# EasyEDA Pro project ProProject_IR sensor board_2024-06-21.epro, schematic Schematic1
Create Date: 2024-04-04; Page Name: P1; Project Name: IR sensor board; Schematic Name: Schematic1; Update Date: 2024-04-17; Company: EasyEDA.com; Drawn: EasyEDA; Page Size: A4; Part Number: JLCPCB-002; Reviewed: EasyEDA; Version: V0.1
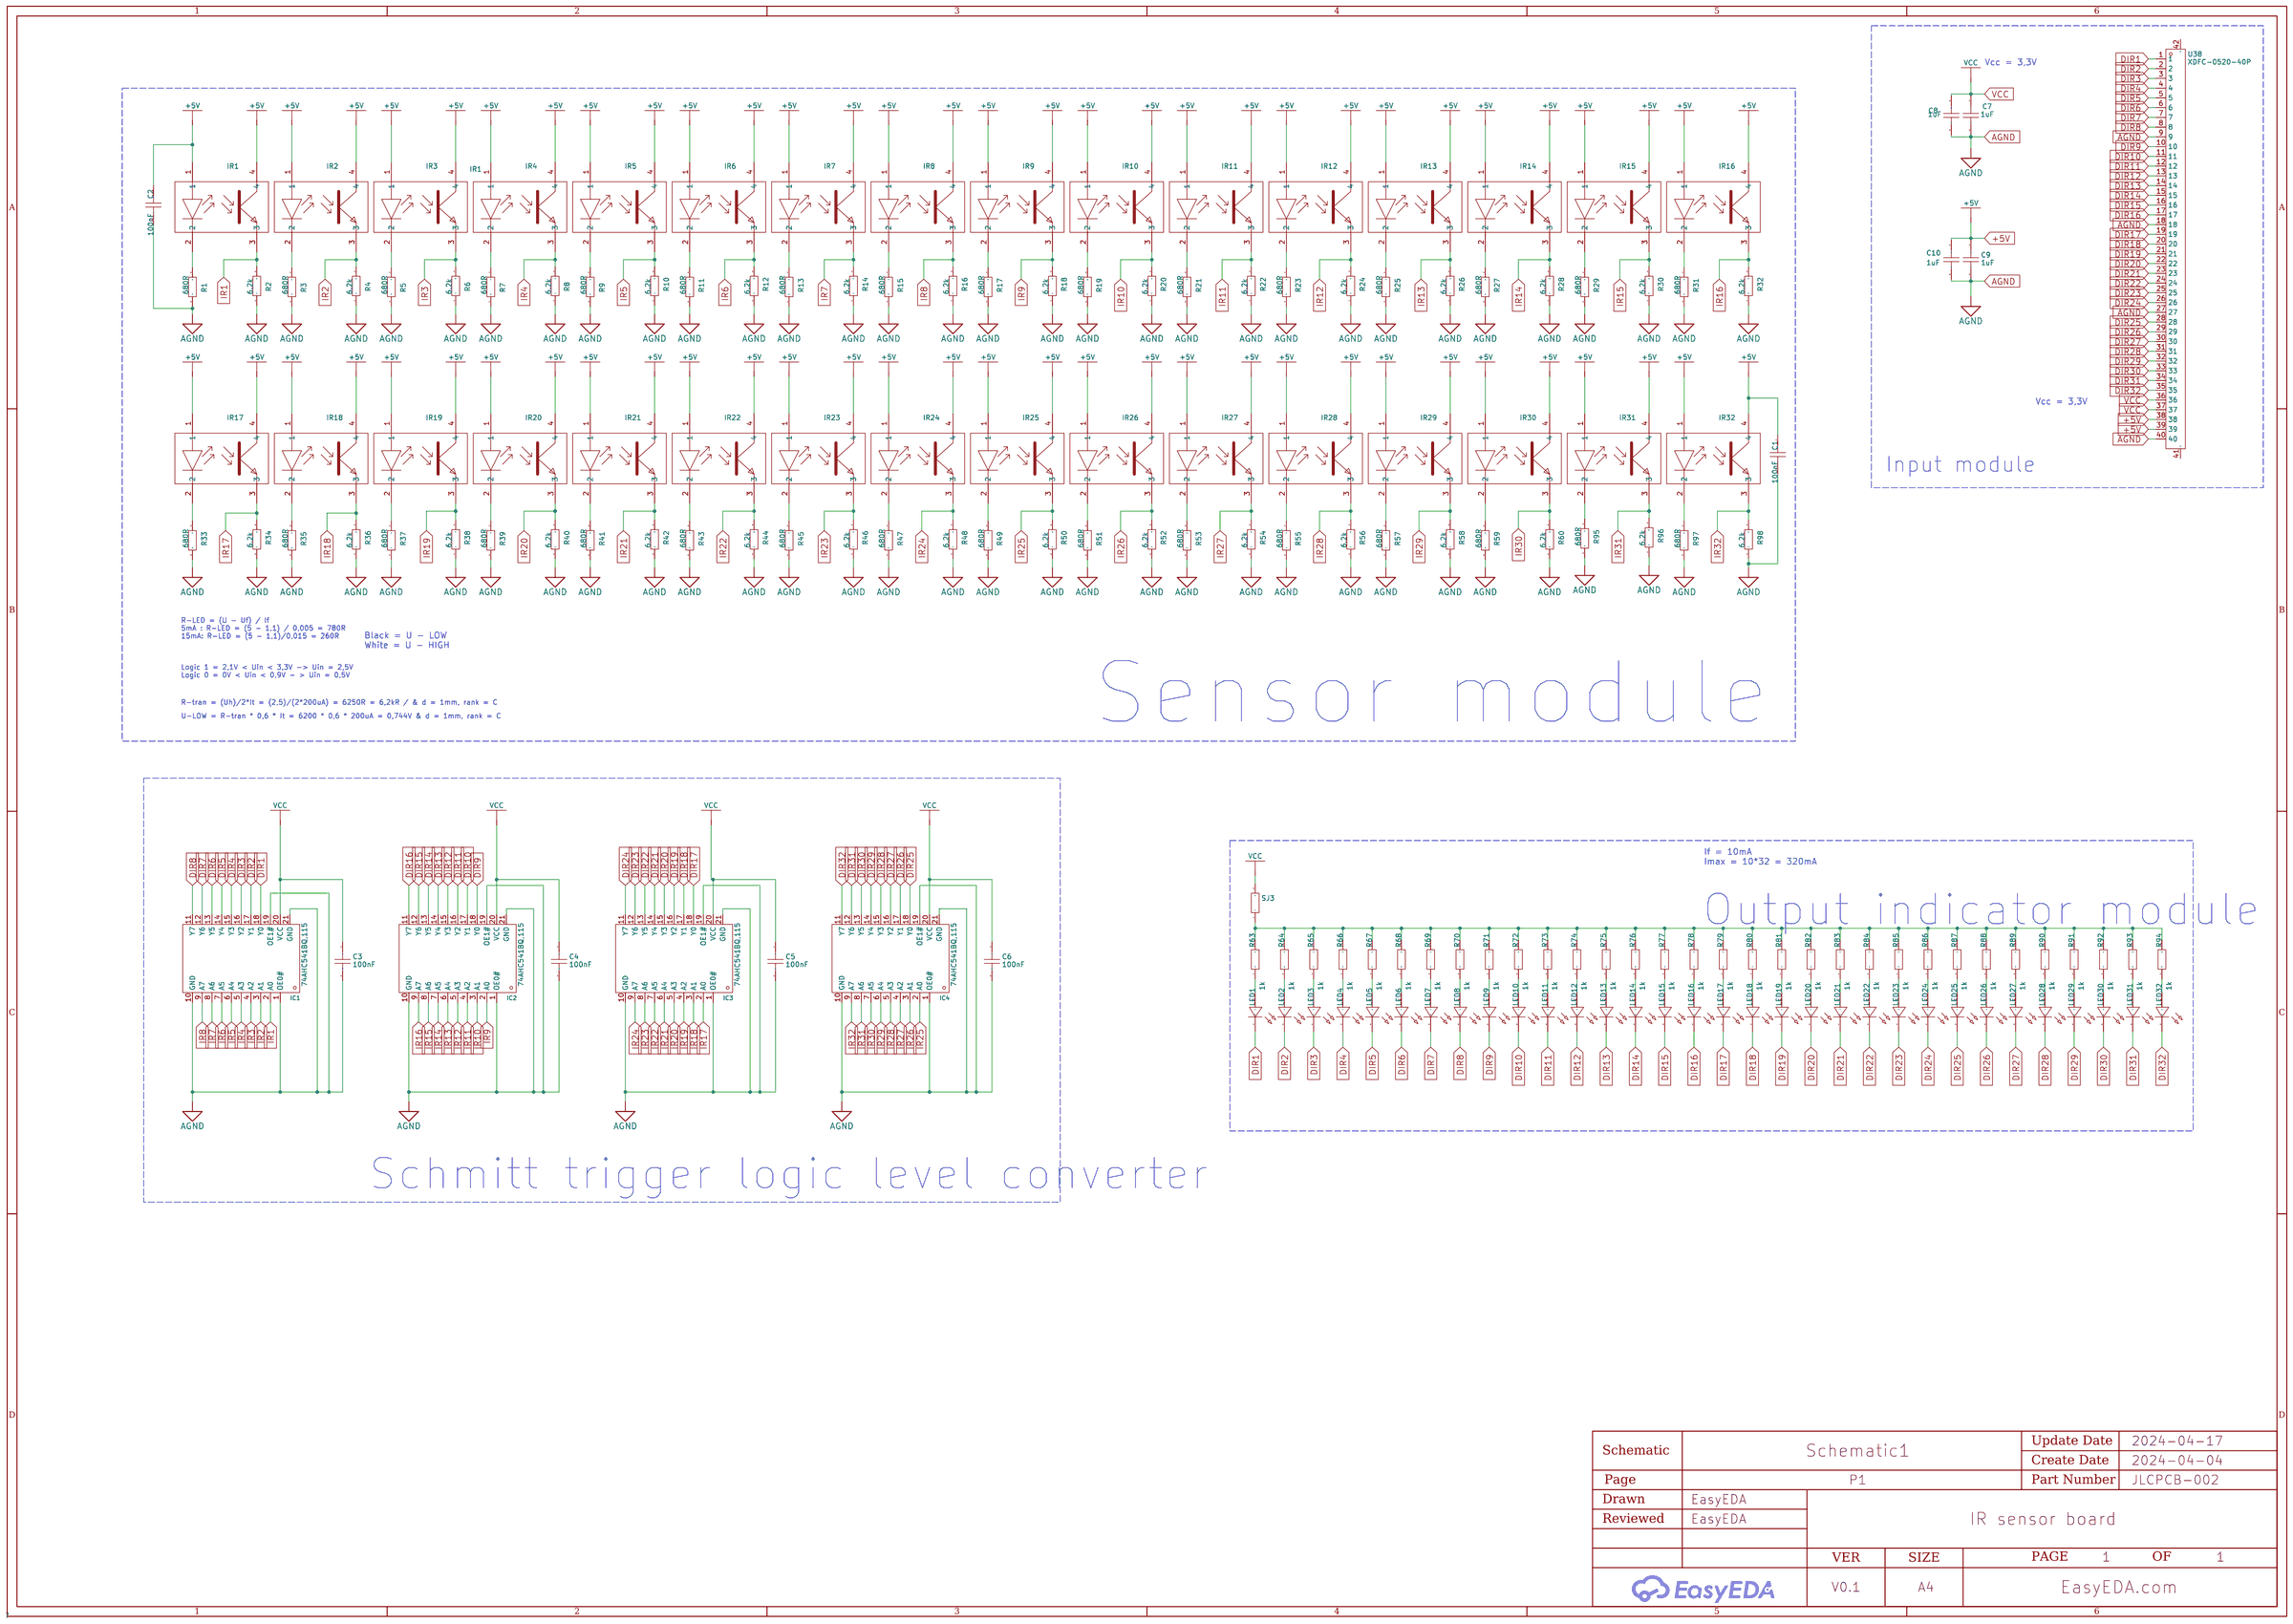
[diagram p0: schematic sheet]

## Parts
C1  100nF  [C0603]
C2  100nF  [C0603]
C3  100nF  [C0603]
C4  100nF  [C0603]
C5  100nF  [C0603]
C6  100nF  [C0603]
C7  1uF  [C0603]
C8  1uF  [C0603]
C9  1uF  [C0603]
C10  1uF  [C0603]
IC1  74AHC541BQ,115  [DHVQFN20_L4.5-W2.5-P0.50-BL-EP]
IC2  74AHC541BQ,115  [DHVQFN20_L4.5-W2.5-P0.50-BL-EP]
IC3  74AHC541BQ,115  [DHVQFN20_L4.5-W2.5-P0.50-BL-EP]
IC4  74AHC541BQ,115  [DHVQFN20_L4.5-W2.5-P0.50-BL-EP]
IR1  -  [KU163]
IR2  -  [KU163]
IR3  IR1  [KU163]
IR4  -  [KU163]
IR5  -  [KU163]
IR6  -  [KU163]
IR7  -  [KU163]
IR8  -  [KU163]
IR9  -  [KU163]
IR10  -  [KU163]
IR11  -  [KU163]
IR12  -  [KU163]
IR13  -  [KU163]
IR14  -  [KU163]
IR15  -  [KU163]
IR16  -  [KU163]
IR17  -  [KU163]
IR18  -  [KU163]
IR19  -  [KU163]
IR20  -  [KU163]
IR21  -  [KU163]
IR22  -  [KU163]
IR23  -  [KU163]
IR24  -  [KU163]
IR25  -  [KU163]
IR26  -  [KU163]
IR27  -  [KU163]
IR28  -  [KU163]
IR29  -  [KU163]
IR30  -  [KU163]
IR31  -  [KU163]
IR32  -  [KU163]
LED1  -  [LED0805-RD_GREEN]
LED2  -  [LED0805-RD_GREEN]
LED3  -  [LED0805-RD_GREEN]
LED4  -  [LED0805-RD_GREEN]
LED5  -  [LED0805-RD_GREEN]
LED6  -  [LED0805-RD_GREEN]
LED7  -  [LED0805-RD_GREEN]
LED8  -  [LED0805-RD_GREEN]
LED9  -  [LED0805-RD_GREEN]
LED10  -  [LED0805-RD_GREEN]
LED11  -  [LED0805-RD_GREEN]
LED12  -  [LED0805-RD_GREEN]
LED13  -  [LED0805-RD_GREEN]
LED14  -  [LED0805-RD_GREEN]
LED15  -  [LED0805-RD_GREEN]
LED16  -  [LED0805-RD_GREEN]
LED17  -  [LED0805-RD_GREEN]
LED18  -  [LED0805-RD_GREEN]
LED19  -  [LED0805-RD_GREEN]
LED20  -  [LED0805-RD_GREEN]
LED21  -  [LED0805-RD_GREEN]
LED22  -  [LED0805-RD_GREEN]
LED23  -  [LED0805-RD_GREEN]
LED24  -  [LED0805-RD_GREEN]
LED25  -  [LED0805-RD_GREEN]
LED26  -  [LED0805-RD_GREEN]
LED27  -  [LED0805-RD_GREEN]
LED28  -  [LED0805-RD_GREEN]
LED29  -  [LED0805-RD_GREEN]
LED30  -  [LED0805-RD_GREEN]
LED31  -  [LED0805-RD_GREEN]
LED32  -  [LED0805-RD_GREEN]
R1  680R  [R0603]
R2  6.2k  [R0603]
R3  680R  [R0603]
R4  6.2k  [R0603]
R5  680R  [R0603]
R6  6.2k  [R0603]
R7  680R  [R0603]
R8  6.2k  [R0603]
R9  680R  [R0603]
R10  6.2k  [R0603]
R11  680R  [R0603]
R12  6.2k  [R0603]
R13  680R  [R0603]
R14  6.2k  [R0603]
R15  680R  [R0603]
R16  6.2k  [R0603]
R17  680R  [R0603]
R18  6.2k  [R0603]
R19  680R  [R0603]
R20  6.2k  [R0603]
R21  680R  [R0603]
R22  6.2k  [R0603]
R23  680R  [R0603]
R24  6.2k  [R0603]
R25  680R  [R0603]
R26  6.2k  [R0603]
R27  680R  [R0603]
R28  6.2k  [R0603]
R29  680R  [R0603]
R30  6.2k  [R0603]
R31  680R  [R0603]
R32  6.2k  [R0603]
R33  680R  [R0603]
R34  6.2k  [R0603]
R35  680R  [R0603]
R36  6.2k  [R0603]
R37  680R  [R0603]
R38  6.2k  [R0603]
R39  680R  [R0603]
R40  6.2k  [R0603]
R41  680R  [R0603]
R42  6.2k  [R0603]
R43  680R  [R0603]
R44  6.2k  [R0603]
R45  680R  [R0603]
R46  6.2k  [R0603]
R47  680R  [R0603]
R48  6.2k  [R0603]
R49  680R  [R0603]
R50  6.2k  [R0603]
R51  680R  [R0603]
R52  6.2k  [R0603]
R53  680R  [R0603]
R54  6.2k  [R0603]
R55  680R  [R0603]
R56  6.2k  [R0603]
R57  680R  [R0603]
R58  6.2k  [R0603]
R59  680R  [R0603]
R60  6.2k  [R0603]
R63  1k  [R0603]
R64  1k  [R0603]
R65  1k  [R0603]
R66  1k  [R0603]
R67  1k  [R0603]
R68  1k  [R0603]
R69  1k  [R0603]
R70  1k  [R0603]
R71  1k  [R0603]
R72  1k  [R0603]
R73  1k  [R0603]
R74  1k  [R0603]
R75  1k  [R0603]
R76  1k  [R0603]
R77  1k  [R0603]
R78  1k  [R0603]
R79  1k  [R0603]
R80  1k  [R0603]
R81  1k  [R0603]
R82  1k  [R0603]
R83  1k  [R0603]
R84  1k  [R0603]
R85  1k  [R0603]
R86  1k  [R0603]
R87  1k  [R0603]
R88  1k  [R0603]
R89  1k  [R0603]
R90  1k  [R0603]
R91  1k  [R0603]
R92  1k  [R0603]
R93  1k  [R0603]
R94  1k  [R0603]
R95  680R  [R0603]
R96  6.2k  [R0603]
R97  680R  [R0603]
R98  6.2k  [R0603]
SJ3  10K  [R0603]
U38  XDFC-0520-40P  [CONN-SMD_40P-P0.50_F31L-1A7H1-21040]

## Library data of the parts
C1-C10 = CAP_0603: Supplier Footprint: 0603
IC1-IC4 = 74AHC541BQ,115: Input type:- output type:Tri-State Supply Voltage:2V~5.5V Supply Voltage:2V~5.5V Sink Current:8mA Source Current:8mA Operating Temperature:-40℃~+125℃ Operating Temperature:-40℃~+125℃; Supplier Part: C554413; Manufacturer: Nexperia(安世); Supplier Footprint: DHVQFN-20-EP(2.5x4.5); JLCPCB Part Class: Extended Part; Datasheet: https://atta.szlcsc.com/upload/public/pdf/source/20200610/C554413_43417DF4E1A0FE8D6036EFFA5DDF653E.pdf; Supplier: LCSC; output type: Tri-State; Supply Voltage: 2V~5.5V; Sink Current: 8mA; Source Current: 8mA; Operating Temperature: -40℃~+125℃
IR1-IR32 = KU163: IR reflection sensor
LED1-LED32 = LED_0805-G: Supplier Footprint: 0805
R1-R60 R63-R98 SJ3 = Res_0603: Supplier Footprint: 0603
U38 = XDFC-0520-40P: Locking Feature:Clamshell Contact Type:Bottom Contact Number of Contacts:40P Pitch:0.5mm Mounting Type:卧贴 FFC, FCB Thickness:0.3mm FFC, FCB Thickness:0.3mm Height Above Board:2mm Contact Material:铜端 Contact Plating:Gold Operating Temperature Range:-40℃~+8; LCSC Part Name: FFC/FPC连接器 PH0.5-40PIN H2.0MM 翻盖式 下接/前翻; Supplier Part: C7527551; Manufacturer: LX(连欣科技); Supplier Footprint: SMD,P=0.5mm; JLCPCB Part Class: Extended Part; Datasheet: https://atta.szlcsc.com/upload/public/pdf/source/20230918/BC9D90A2478B1F11DE066C6B09D8BA06.pdf; Supplier: LCSC; Locking Feature: Clamshell; Contact Type: Bottom Contact; Number of Contacts: 40P; Pitch: 0.5mm; Mounting Type: 卧贴; FFC, FCB Thickness: 0.3mm; Height Above Board: 2mm; Contact Material: 铜端; Contact Plating: Gold; Operating Temperature Range: -40℃~+85℃; Soldering Temperature(Max): 265℃

## Nets
+5V: C1.1 C2.1 C9.1 C10.1 IR1.1 IR1.4 IR2.1 IR2.4 IR3.1 IR3.4 IR4.1 IR4.4 IR5.1 IR5.4 IR6.1 IR6.4 IR7.1 IR7.4 IR8.1 IR8.4 IR9.1 IR9.4 IR10.1 IR10.4 IR11.1 IR11.4 IR12.1 IR12.4 IR13.1 IR13.4 IR14.1 IR14.4 IR15.1 IR15.4 IR16.1 IR16.4 IR17.1 IR17.4 IR18.1 IR18.4 IR19.1 IR19.4 IR20.1 IR20.4 IR21.1 IR21.4 IR22.1 IR22.4 IR23.1 IR23.4 IR24.1 IR24.4 IR25.1 IR25.4 IR26.1 IR26.4 IR27.1 IR27.4 IR28.1 IR28.4 IR29.1 IR29.4 IR30.1 IR30.4 IR31.1 IR31.4 IR32.1 IR32.4 U38.38 U38.39
AGND: C1.2 C2.2 C3.2 C4.2 C5.2 C6.2 C7.2 C8.2 C9.2 C10.2 IC1.1(OE0#) IC1.10(GND) IC1.19(OE1#) IC1.21(GND) IC2.1(OE0#) IC2.10(GND) IC2.19(OE1#) IC2.21(GND) IC3.1(OE0#) IC3.10(GND) IC3.19(OE1#) IC3.21(GND) IC4.1(OE0#) IC4.10(GND) IC4.19(OE1#) IC4.21(GND) R1.2 R2.1 R3.2 R4.1 R5.2 R6.1 R7.2 R8.1 R9.2 R10.1 R11.2 R12.1 R13.2 R14.1 R15.2 R16.1 R17.2 R18.1 R19.2 R20.1 R21.2 R22.1 R23.2 R24.1 R25.2 R26.1 R27.2 R28.1 R29.2 R30.1 R31.2 R32.1 R33.2 R34.1 R35.2 R36.1 R37.2 R38.1 R39.2 R40.1 R41.2 R42.1 R43.2 R44.1 R45.2 R46.1 R47.2 R48.1 R49.2 R50.1 R51.2 R52.1 R53.2 R54.1 R55.2 R56.1 R57.2 R58.1 R59.2 R60.1 R95.2 R96.1 R97.2 R98.1 U38.9 U38.18 U38.27 U38.40
VCC: C3.1 C4.1 C5.1 C6.1 C7.1 C8.1 IC1.20(VCC) IC2.20(VCC) IC3.20(VCC) IC4.20(VCC) SJ3.2 U38.36 U38.37
DIR1: IC1.18(Y0) LED1.1(C) U38.1
DIR2: IC1.17(Y1) LED2.1(C) U38.2
DIR3: IC1.16(Y2) LED3.1(C) U38.3
DIR4: IC1.15(Y3) LED4.1(C) U38.4
DIR5: IC1.14(Y4) LED5.1(C) U38.5
DIR6: IC1.13(Y5) LED6.1(C) U38.6
DIR7: IC1.12(Y6) LED7.1(C) U38.7
DIR8: IC1.11(Y7) LED8.1(C) U38.8
DIR9: IC2.18(Y0) LED9.1(C) U38.10
DIR10: IC2.17(Y1) LED10.1(C) U38.11
DIR11: IC2.16(Y2) LED11.1(C) U38.12
DIR12: IC2.15(Y3) LED12.1(C) U38.13
DIR13: IC2.14(Y4) LED13.1(C) U38.14
DIR14: IC2.13(Y5) LED14.1(C) U38.15
DIR15: IC2.12(Y6) LED15.1(C) U38.16
DIR16: IC2.11(Y7) LED16.1(C) U38.17
DIR17: IC3.18(Y0) LED17.1(C) U38.19
DIR18: IC3.17(Y1) LED18.1(C) U38.20
DIR19: IC3.16(Y2) LED19.1(C) U38.21
DIR20: IC3.15(Y3) LED20.1(C) U38.22
DIR21: IC3.14(Y4) LED21.1(C) U38.23
DIR22: IC3.13(Y5) LED22.1(C) U38.24
DIR23: IC3.12(Y6) LED23.1(C) U38.25
DIR24: IC3.11(Y7) LED24.1(C) U38.26
DIR25: IC4.18(Y0) LED25.1(C) U38.28
DIR26: IC4.17(Y1) LED26.1(C) U38.29
DIR27: IC4.16(Y2) LED27.1(C) U38.30
DIR28: IC4.15(Y3) LED28.1(C) U38.31
DIR29: IC4.14(Y4) LED29.1(C) U38.32
DIR30: IC4.13(Y5) LED30.1(C) U38.33
DIR31: IC4.12(Y6) LED31.1(C) U38.34
DIR32: IC4.11(Y7) LED32.1(C) U38.35
IR1: IC1.2(A0) IR1.3 R2.2
IR2: IC1.3(A1) IR2.3 R4.2
IR3: IC1.4(A2) IR3.3 R6.2
IR4: IC1.5(A3) IR4.3 R8.2
IR5: IC1.6(A4) IR5.3 R10.2
IR6: IC1.7(A5) IR6.3 R12.2
IR7: IC1.8(A6) IR7.3 R14.2
IR8: IC1.9(A7) IR8.3 R16.2
IR9: IC2.2(A0) IR9.3 R18.2
IR10: IC2.3(A1) IR10.3 R20.2
IR11: IC2.4(A2) IR11.3 R22.2
IR12: IC2.5(A3) IR12.3 R24.2
IR13: IC2.6(A4) IR13.3 R26.2
IR14: IC2.7(A5) IR14.3 R28.2
IR15: IC2.8(A6) IR15.3 R30.2
IR16: IC2.9(A7) IR16.3 R32.2
IR17: IC3.2(A0) IR17.3 R34.2
IR18: IC3.3(A1) IR18.3 R36.2
IR19: IC3.4(A2) IR19.3 R38.2
IR20: IC3.5(A3) IR20.3 R40.2
IR21: IC3.6(A4) IR21.3 R42.2
IR22: IC3.7(A5) IR22.3 R44.2
IR23: IC3.8(A6) IR23.3 R46.2
IR24: IC3.9(A7) IR24.3 R48.2
IR25: IC4.2(A0) IR25.3 R50.2
IR26: IC4.3(A1) IR26.3 R52.2
IR27: IC4.4(A2) IR27.3 R54.2
IR28: IC4.5(A3) IR28.3 R56.2
IR29: IC4.6(A4) IR29.3 R58.2
IR30: IC4.7(A5) IR30.3 R60.2
IR31: IC4.8(A6) IR31.3 R96.2
IR32: IC4.9(A7) IR32.3 R98.2
$1N6653: IR2.2 R3.1
$1N6781: IR3.2 R5.1
$1N6909: IR4.2 R7.1
$1N7037: IR5.2 R9.1
$1N7165: IR6.2 R11.1
$1N7293: IR7.2 R13.1
$1N7421: IR8.2 R15.1
$1N7549: IR9.2 R17.1
$1N7677: IR10.2 R19.1
$1N7805: IR11.2 R21.1
$1N7933: IR12.2 R23.1
$1N8061: IR13.2 R25.1
$1N8189: IR14.2 R27.1
$1N8317: IR15.2 R29.1
$1N8445: IR16.2 R31.1
$1N10253: IR17.2 R33.1
$1N10265: IR18.2 R35.1
$1N10277: IR19.2 R37.1
$1N10289: IR20.2 R39.1
$1N10301: IR21.2 R41.1
$1N10313: IR22.2 R43.1
$1N10325: IR23.2 R45.1
$1N10337: IR24.2 R47.1
$1N10349: IR25.2 R49.1
$1N10361: IR26.2 R51.1
$1N10373: IR27.2 R53.1
$1N10385: IR28.2 R55.1
$1N10397: IR29.2 R57.1
$1N10409: IR30.2 R59.1
$1N20190: LED1.2(A) R63.1
$1N20287: LED2.2(A) R64.1
$1N20383: LED3.2(A) R65.1
$1N20385: LED4.2(A) R66.1
$1N20575: LED5.2(A) R67.1
$1N20577: LED6.2(A) R68.1
$1N20579: LED7.2(A) R69.1
$1N20581: LED8.2(A) R70.1
$1N20959: LED9.2(A) R71.1
$1N20961: LED10.2(A) R72.1
$1N20963: LED11.2(A) R73.1
$1N20965: LED12.2(A) R74.1
$1N20967: LED13.2(A) R75.1
$1N20969: LED14.2(A) R76.1
$1N20971: LED15.2(A) R77.1
$1N20973: LED16.2(A) R78.1
$1N22511: LED17.2(A) R79.1
$1N22513: LED18.2(A) R80.1
$1N22515: LED19.2(A) R81.1
$1N22517: LED20.2(A) R82.1
$1N22519: LED21.2(A) R83.1
$1N22521: LED22.2(A) R84.1
$1N22523: LED23.2(A) R85.1
$1N22525: LED24.2(A) R86.1
$1N22527: LED25.2(A) R87.1
$1N22529: LED26.2(A) R88.1
$1N22531: LED27.2(A) R89.1
$1N22533: LED28.2(A) R90.1
$1N22535: LED29.2(A) R91.1
$1N22537: LED30.2(A) R92.1
$1N22539: LED31.2(A) R93.1
$1N22541: LED32.2(A) R94.1
$1N26335: IR1.2 R1.1
$1N29013: R63.2 R64.2 R65.2 R66.2 R67.2 R68.2 R69.2 R70.2 R71.2 R72.2 R73.2 R74.2 R75.2 R76.2 R77.2 R78.2 R79.2 R80.2 R81.2 R82.2 R83.2 R84.2 R85.2 R86.2 R87.2 R88.2 R89.2 R90.2 R91.2 R92.2 R93.2 R94.2 SJ3.1
$1N30161: IR31.2 R95.1
$1N30166: IR32.2 R97.1

Not connected (* = marked no-connect by the designer): U38 41 42

## Notes on the sheet
- Vcc = 3,3V
- Vcc = 3,3V
- Input module
- R-LED = (U - Uf) / If
  5mA : R-LED = (5 - 1,1) / 0,005 = 780R
  15mA: R-LED = (5 - 1,1)/0,015 = 260R
- Black = U - LOW
  White = U - HIGH
- Logic 1 = 2,1V < Uin < 3,3V -> Uin = 2,5V
  Logic 0 = 0V < Uin < 0,9V - > Uin = 0,5V
- R-tran = (Uh)/2*It = (2,5)/(2*200uA) = 6250R = 6,2kR / & d = 1mm, rank = C
- U-LOW = R-tran * 0,6 * It = 6200 * 0,6 * 200uA = 0,744V & d = 1mm, rank = C
- Sensor module
- If = 10mA
  Imax = 10*32 = 320mA
- Output indicator module
- Schmitt trigger logic level converter
